# Altium schematic sheet Bluetooth modul.SchDoc
size A4
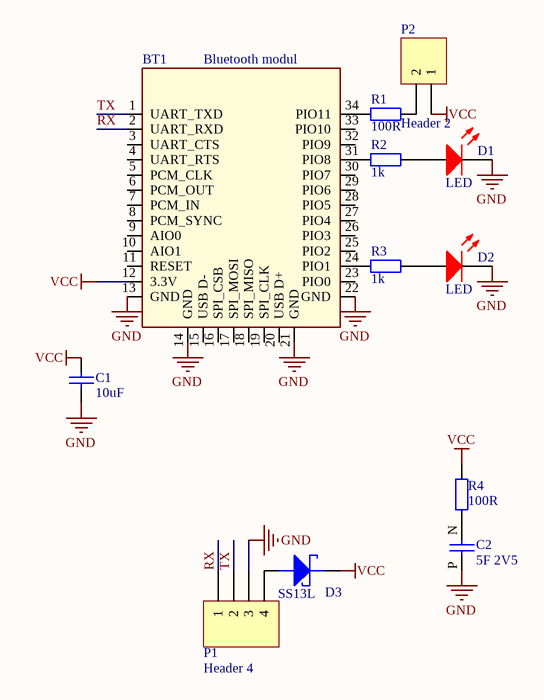
[diagram p0: Bluetooth modul.SchDoc]

## Parts
BT1  Bluetooth modul  [BT_modul]
C1  10uF  [FP_0603_CAP_080]
C2  5F 2V5  [Supercapacitor_10x20mm]
D1  LED  [FP_0805_LED_RED]
D2  LED  [FP_0805_LED_RED]
D3  SS13L  [subsma]
P1  Header 4  [HDR1X4]
P2  Header 2  [HDR1X2]
R1  100R  [FP_0603_RES]
R2  1k  [FP_0603_RES]
R3  1k  [FP_0603_RES]
R4  100R  [FP_0603_RES]

## Nets
GND: BT1.13(GND) BT1.14(GND) BT1.21(GND) BT1.22(GND) C1.1 C2.P D1.K D2.K P1.3
VCC: BT1.12(3.3V) C1.2 D3.K P2.1 R4.2
RX: BT1.2(UART_RXD) P1.1
TX: BT1.1(UART_TXD) P1.2
NetBT1_24: BT1.24(PIO1) R3.2
NetBT1_31: BT1.31(PIO8) R2.2
NetBT1_34: BT1.34(PIO11) R1.2
NetC2_N: C2.N R4.1
NetD1_A: D1.A R2.1
NetD2_A: D2.A R3.1
NetD3_A: D3.A P1.4
NetP2_2: P2.2 R1.1

Not connected (* = marked no-connect by the designer): BT1 3(UART_CTS) 4(UART_RTS) 5(PCM_CLK) 6(PCM_OUT) 7(PCM_IN) 8(PCM_SYNC) 9(AIO0) 10(AIO1) 11(RESET) 15(USB_D-) 16(SPI_CSB) 17(SPI_MOSI) 18(SPI_MISO) 19(SPI_CLK) 20(USB_D+) 23(PIO0) 25(PIO2) 26(PIO3) 27(PIO4) 28(PIO5) 29(PIO6) 30(PIO7) 32(PIO9) 33(PIO10)

## Library data of the parts
BT1 = Bluetooth modul: Wireless Bluetooth Transceiver Module RS232 / TTL
C1 = CAP: Capacitor; Value: 10uF
C2 = Supercap 5F 2V5
D1 D2 = LED_R: Typical LED
D3 = SCHOTTKY: NXP - PMEG3020EJ,115 - SCHOTTKY RECT 30V 2A SOD323F; Order info: http://hu.mouser.com/ProductDetail/Taiwan-Semiconductor/SS13L/?qs=sGAEpiMZZMtQ8nqTKtFS%2fM7yU4XpC0IDN%2fn3%252b2dW0Dg%3d
P1 = Header 4: Header, 4-Pin; LatestRevisionDate: 17-Jul-2002; LatestRevisionNote: Re-released for DXP Platform.; Publisher: Altium Limited
P2 = Header 2: Header, 2-Pin; LatestRevisionDate: 17-Jul-2002; LatestRevisionNote: Re-released for DXP Platform.; Publisher: Altium Limited
R1-R4 = RES: Resistor
  R1 R4: Value: 100R
  R2 R3: Value: 1k